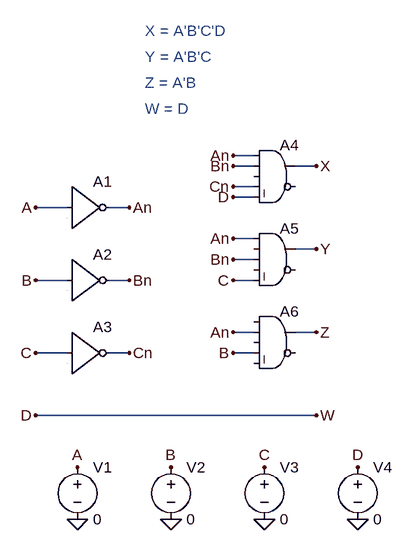
[diagram p0: schematic Exercise2.asc]
Exercise2.asc, the LTspice schematic file:
Version 4
SHEET 1 1156 680
WIRE 608 -208 576 -208
WIRE 608 -192 576 -192
WIRE 704 -192 672 -192
WIRE 608 -160 576 -160
WIRE 608 -144 576 -144
WIRE 320 -128 272 -128
WIRE 416 -128 384 -128
WIRE 608 -80 576 -80
WIRE 704 -64 672 -64
WIRE 608 -48 576 -48
WIRE 320 -16 272 -16
WIRE 416 -16 384 -16
WIRE 608 -16 576 -16
WIRE 608 64 576 64
WIRE 704 64 672 64
WIRE 320 96 272 96
WIRE 416 96 384 96
WIRE 608 96 576 96
WIRE 704 192 272 192
FLAG 336 352 0
FLAG 480 352 0
FLAG 624 352 0
FLAG 768 352 0
FLAG 336 272 A
FLAG 480 272 B
FLAG 624 272 C
FLAG 768 272 D
FLAG 272 -128 A
FLAG 272 -16 B
FLAG 272 96 C
FLAG 416 -128 An
FLAG 416 -16 Bn
FLAG 416 96 Cn
FLAG 576 -208 An
FLAG 576 -192 Bn
FLAG 576 -160 Cn
FLAG 576 -144 D
FLAG 704 -192 X
FLAG 704 -64 Y
FLAG 704 64 Z
FLAG 576 -80 An
FLAG 576 -48 Bn
FLAG 576 -16 C
FLAG 576 64 An
FLAG 576 96 B
FLAG 272 192 D
FLAG 704 192 W
SYMBOL voltage 336 256 R0
WINDOW 123 0 0 Left 0
WINDOW 39 0 0 Left 0
SYMATTR InstName V1
SYMATTR Value 0
SYMBOL voltage 480 256 R0
WINDOW 123 0 0 Left 0
WINDOW 39 0 0 Left 0
SYMATTR InstName V2
SYMATTR Value 0
SYMBOL voltage 624 256 R0
WINDOW 123 0 0 Left 0
WINDOW 39 0 0 Left 0
SYMATTR InstName V3
SYMATTR Value 0
SYMBOL voltage 768 256 R0
WINDOW 123 0 0 Left 0
WINDOW 39 0 0 Left 0
SYMATTR InstName V4
SYMATTR Value 0
SYMBOL Digital\\inv 320 -192 R0
SYMATTR InstName A1
SYMATTR SpiceLine vhigh=5V
SYMBOL Digital\\inv 320 -80 R0
SYMATTR InstName A2
SYMATTR SpiceLine vhigh=5V
SYMBOL Digital\\inv 320 32 R0
SYMATTR InstName A3
SYMATTR SpiceLine vhigh=5V
SYMBOL Digital\\and 640 -240 R0
SYMATTR InstName A4
SYMATTR SpiceLine vhigh=5V
SYMBOL Digital\\and 640 -112 R0
SYMATTR InstName A5
SYMATTR SpiceLine vhigh=5V
SYMBOL Digital\\and 640 16 R0
SYMATTR InstName A6
SYMATTR SpiceLine vhigh=5V
TEXT 440 -400 Left 2 ;X = A'B'C'D
TEXT 440 -360 Left 2 ;Y = A'B'C
TEXT 440 -320 Left 2 ;Z = A'B
TEXT 440 -280 Left 2 ;W = D

The netlist it stands for:
* Exercise2.asc
V1 A 0 0
V2 B 0 0
V3 C 0 0
V4 W 0 0
A1 A 0 0 0 0 An 0 0 BUF vhigh=5V
A2 B 0 0 0 0 Bn 0 0 BUF vhigh=5V
A3 C 0 0 0 0 Cn 0 0 BUF vhigh=5V
A4 An Bn 0 Cn W 0 X 0 AND vhigh=5V
A5 An 0 Bn 0 C 0 Y 0 AND vhigh=5V
A6 0 An 0 B 0 0 Z 0 AND vhigh=5V
* X = A'B'C'D
* Y = A'B'C
* Z = A'B
* W = D
.backanno
.end